# Altium schematic sheet PhoneBLE_v101.SchDoc
size OrCAD B; DocumentNumber: BELNoKey100; ProjectName: BELNoKey100
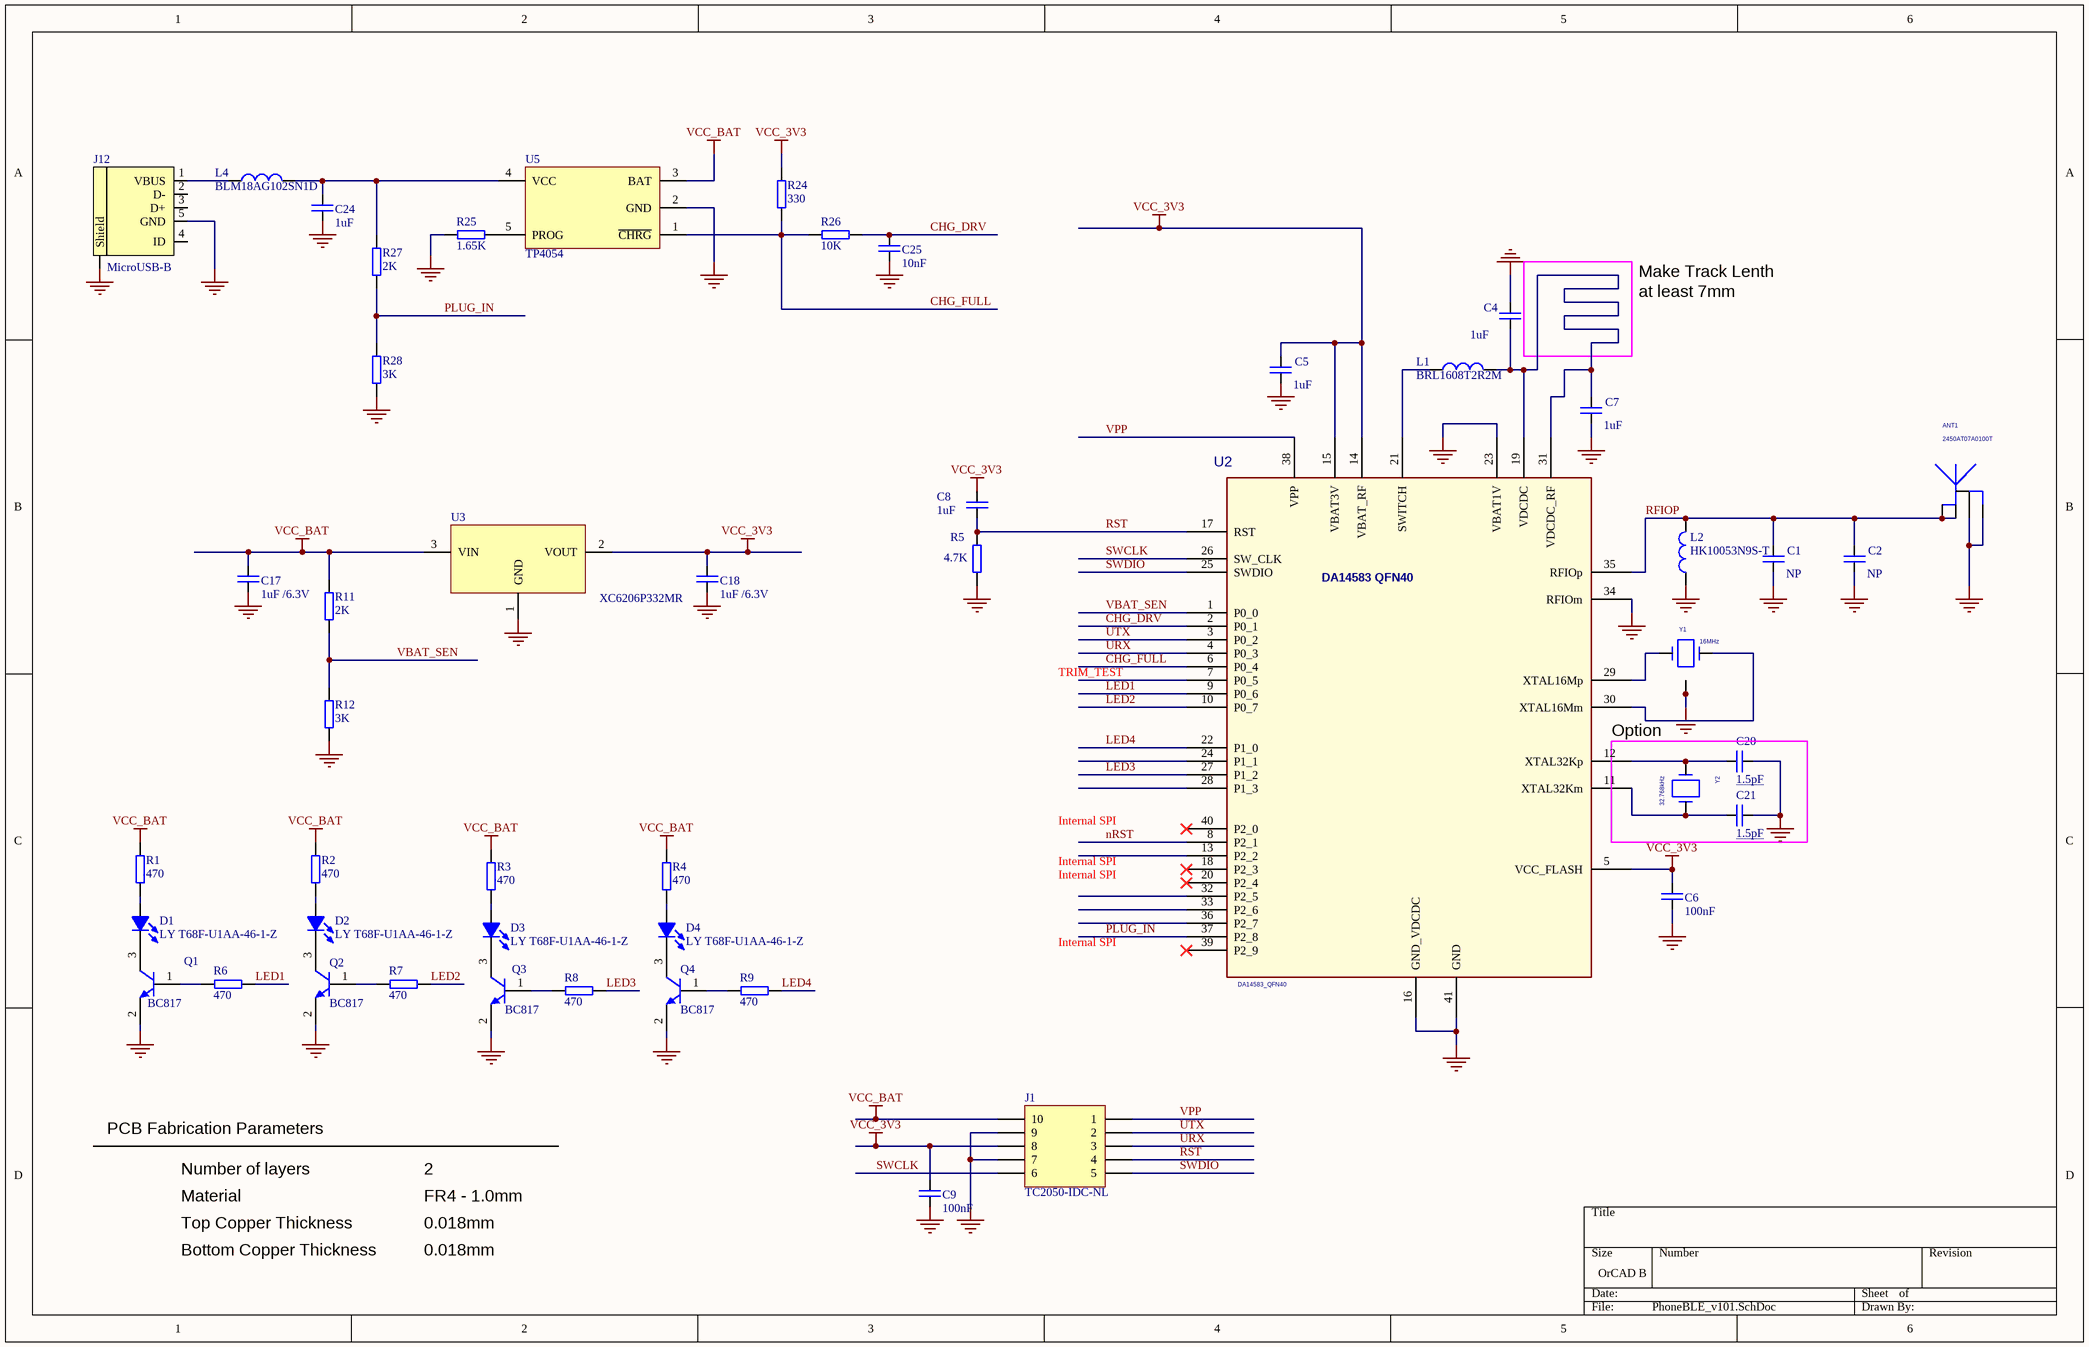
[diagram p0: PhoneBLE_v101.SchDoc]

## Parts
ANT1  2450AT07A0100T  [ANT1005]
C1  NP  [S_C1005]
C2  NP  [S_C1005]
C4  1uF  [C1005]
C5  1uF  [C1005]
C6  100nF  [C1005]
C7  1uF  [C1005]
C8  1uF  [C1005]
C9  100nF  [C1005]
C17  1uF /6.3V  [C1005]
C18  1uF /6.3V  [C1005]
C20  1.5pF  [C1005]
C21  1.5pF  [C1005]
C24  1uF  [S_C1005]
C25  10nF  [S_C1005]
D1  LY T68F-U1AA-46-1-Z  [T68F_Z]
D2  LY T68F-U1AA-46-1-Z  [T68F_Z]
D3  LY T68F-U1AA-46-1-Z  [T68F_Z]
D4  LY T68F-U1AA-46-1-Z  [T68F_Z]
J1  TC2050-IDC-NL  [SMD-10]
J12  MicroUSB-B  [FCI_10118193-0001LF]
L1  BRL1608T2R2M  [L1608]
L2  HK10053N9S-T  [L1005]
L4  BLM18AG102SN1D  [S_L1608]
Q1  BC817  [SOT-23]
Q2  BC817  [SOT-23]
Q3  BC817  [SOT-23]
Q4  BC817  [SOT-23]
R1  470  [R1005]
R2  470  [R1005]
R3  470  [R1005]
R4  470  [R1005]
R5  4.7K  [R1005]
R6  470  [R1005]
R7  470  [R1005]
R8  470  [R1005]
R9  470  [R1005]
R11  2K  [R1005]
R12  3K  [R1005]
R24  330  [S_R1005]
R25  1.65K  [S_R1005]
R26  10K  [S_R1005]
R27  2K  [S_R1005]
R28  3K  [S_R1005]
U2  DA14583_QFN40  [QFN40]
U3  XC6206P332MR  [SOT-23]
U5  TP4054  [SOT23-5]
Y1  16MHz  [SMD2520-4]
Y2  32.768kHz  [XTAL2012]

## Blocks framed on the sheet
Option: C20 C21 Y2

## Nets
GND: ANT1.2(GNDANT1) ANT1.3(GNDANT2) C1.1 C2.1 C4.2 C5.1 C6.1 C7.1 C9.1 C17.1 C18.1 C20.1 C21.1 C24.1 C25.1 J1.7 J1.9 J12.5(GND) J12.6(Shield) L2.1 Q1.2(E) Q2.2(E) Q3.2(E) Q4.2(E) R5.1 R12.1 R25.2 R28.1 U2.16(GND_VDCDC) U2.23(VBAT1V) U2.34(RFIOm) U2.41(GND) U3.1(GND) U5.2(GND) Y1.2 Y1.4
VCC_3V3: C5.2 C6.2 C8.2 C9.2 C18.2 J1.8 R24.1 U2.5(VCC_FLASH) U2.14(VBAT_RF) U2.15(VBAT3V) U3.2(VOUT)
VCC_BAT: C17.2 J1.10 R1.1 R2.1 R3.1 R4.1 R11.2 U3.3(VIN) U5.3(BAT)
CHG_DRV: C25.2 R26.2 U2.2(P0_1)
CHG_FULL: R24.2 R26.1 U2.6(P0_4) U5.1(~{CHRG})
LED1: R6.2 U2.9(P0_6)
LED2: R7.2 U2.10(P0_7)
LED3: R8.2 U2.27(P1_2)
LED4: R9.2 U2.22(P1_0)
nRST: U2.8(P2_1)
PLUG_IN: R27.1 R28.2 U2.37(P2_8)
RFIOP: ANT1.1(FEED1) ANT1.4(FEED2) C1.2 C2.2 L2.2 U2.35(RFIOp)
RST: C8.1 J1.4 R5.2 U2.17(RST)
SWCLK: J1.6 U2.26(SW_CLK)
SWDIO: J1.5 U2.25(SWDIO)
URX: J1.3 U2.4(P0_3)
UTX: J1.2 U2.3(P0_2)
VBAT_SEN: R11.1 R12.2 U2.1(P0_0)
VPP: J1.1 U2.38(VPP)
NetC4_1: C4.1 C7.2 L1.2 U2.19(VDCDC) U2.31(VDCDC_RF)
NetC20_2: C20.2 U2.12(XTAL32Kp) Y2.1
NetC21_2: C21.2 U2.11(XTAL32Km) Y2.2
NetC24_2: C24.2 L4.2 R27.2 U5.4(VCC)
NetD1_A: D1.A R1.2
NetD1_K: D1.K Q1.3(C)
NetD2_A: D2.A R2.2
NetD2_K: D2.K Q2.3(C)
NetD3_A: D3.A R3.2
NetD3_K: D3.K Q3.3(C)
NetD4_A: D4.A R4.2
NetD4_K: D4.K Q4.3(C)
NetJ12_1: J12.1(VBUS) L4.1
NetL1_1: L1.1 U2.21(SWITCH)
NetQ1_1: Q1.1(B) R6.1
NetQ2_1: Q2.1(B) R7.1
NetQ3_1: Q3.1(B) R8.1
NetQ4_1: Q4.1(B) R9.1
NetR25_1: R25.1 U5.5(PROG)
NetU2_29: U2.29(XTAL16Mp) Y1.1
NetU2_30: U2.30(XTAL16Mm) Y1.3

Not connected (* = marked no-connect by the designer): J12 2(D-) 3(D+) 4(ID); U2 7(P0_5) 13(P2_2) 18(P2_3)* 20(P2_4)* 24(P1_1) 28(P1_3) 32(P2_5) 33(P2_6) 36(P2_7) 39(P2_9)* 40(P2_0)*

## Notes on the sheet
- Make Track Lenth
- at least 7mm
- TRIM_TEST
- Internal SPI
- PCB Fabrication Parameters
- Number of layers
- Material
- Top Copper Thickness
- 2
- FR4 - 1.0mm
- 0.018mm
- Bottom Copper Thickness
- (in symbol SC14580_QFN40_1) DA14583 QFN40

## Library data of the parts
ANT1 = ANTENNA_0: Ultra-Miniature 2.4GHz Chip antenna; Manufacturer: Yageo
C1 C2 C4-C9 C17 C18 C20 C21 C24 C25 = CAP-C: Ceramic Capacitor
D1-D4 = D0016: LED Lighting Color XLamp? ML-E Red 625nm (620nm ~ 630nm) 4-SMD, J-Lead Exposed Pad; ba_pn: D0016; current: 30mA; vf: 2.9V; temp_min: -40; temp_max: 85; mfg: Lumileds; mfg_pn: MXZ7-PW57-0000; vendor: Digi-Key; vendor_pn: 1416-1248-1-ND; brightness: 13lm; type: LED; package: 4014
J1 = CONN2X10: Connector, 10-Pin
J12 = FCI 10118193-0001LF: MicroUSB-B-SMT; Manufacturer: FCI; 2nd source part number: 649-10118193-0001LF; Artikkelnr Noca: N.A.; Part Number: FCI 10118193-0001LF; Manufacturer Part Number: 10118193-0001LF; Datasheet: http://portal.fciconnect.com/Comergent//fci/drawing/10118193.pdf; Footprint Doc: FCI_10118193-0001LF; LatestRevisionDate: 2014-10-07; Pin Count: 5; Publisher: Nordic Semiconductor; Published: 2014-10-07; Value: MicroUSB-B; Note: *; Supplier: Digi-Key; Supplier part number: 609-4616-1-ND; 2nd source Supplier: Mouser; Artikkelnr Simpro: N.A.
L1 L4 = Inductor: INDUCTOR Power 2.2uH, 500mA, 400MHz
L2 = Inductor: INDUCTOR, 3.9nH
Q1-Q4 = BC817: NPN General Purpose Amplifier
R1-R9 R11 R12 R24-R28 = RES: Resistor
U2 = SC14580_QFN40_1
U3 = XC6206P332MR: LDO
U5 = TP4054: Standalone Linear Li-lon Battery Charger with Thermal  Regulation in SOT
Y1 = CRYSTAL_4PIN: Manufacturer: NDK; Manufacturer Part Number: NX2520SA; PART_NUMBER: 7M-16.000MEEQ-T; Part Type: Xtal
Y2 = CRYSTAL: PART_NUMBER: ABS06-32.768KHZ-9-T